# EAGLE design M32.v1.2 (EAGLE 7.3.0)

## Sheet 1 of 3
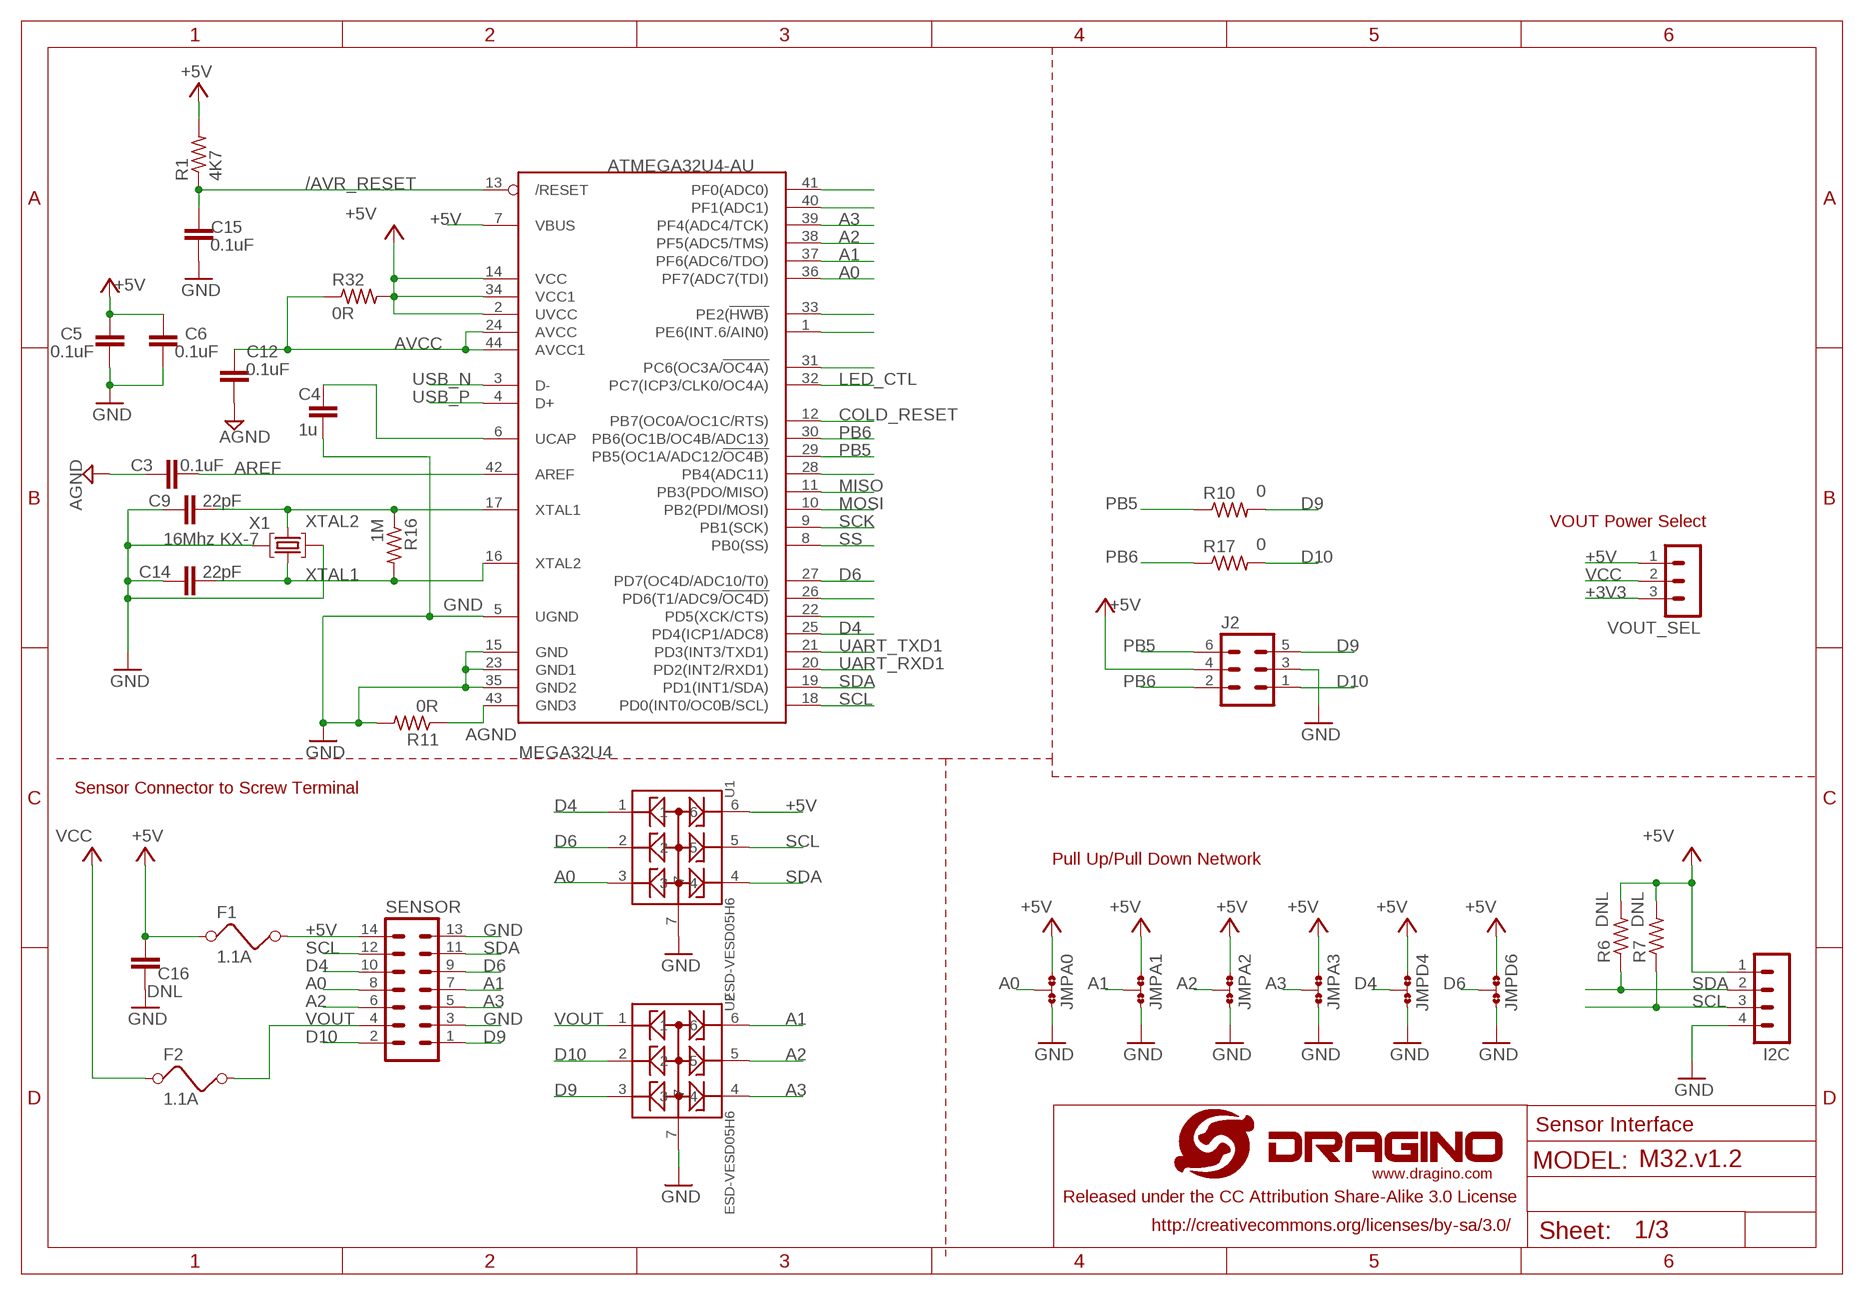
[diagram p0: schematic, sheet 1]

### Parts
C3  0.1uF  C-EUC0402  [C0402]
C4  1u  C-EUC0402  [C0402]
C5  0.1uF  C-EUC0402  [C0402]
C6  0.1uF  C-EUC0402  [C0402]
C9  22pF  C-EUC0402  [C0402]
C12  0.1uF  C-EUC0402  [C0402]
C14  22pF  C-EUC0402  [C0402]
C15  0.1uF  C-EUC0402  [C0402]
C16  DNL  C-EUC0402  [C0402]
F1  1.1A  FUSE1812  [L1812]
F2  1.1A  FUSE1812  [L1812]
I2C  MA04-1  [MA04-1]
J2  MA03-2  [MA03-2]
JMPA0  JUM-A2  0R-JUMPA  [A0R-JMP]
JMPA1  JUM-A2  0R-JUMPA  [A0R-JMP]
JMPA2  JUM-A2  0R-JUMPA  [A0R-JMP]
JMPA3  JUM-A2  0R-JUMPA  [A0R-JMP]
JMPD4  JUM-A2  0R-JUMPA  [A0R-JMP]
JMPD6  JUM-A2  0R-JUMPA  [A0R-JMP]
MEGA32U4  ATMEGA32U4-AU  [TQFP44]
R1  4K7  R-US_R0402  [R0402]
R6  DNL  R-US_R0603  [R0603]
R7  DNL  R-US_R0603  [R0603]
R10  0  R-US_R0603  [R0603]
R11  0R  R-US_R0603  [R0603]
R16  1M  R-US_R0402  [R0402]
R17  0  R-US_R0603  [R0603]
R32  0R  R-US_R0402  [R0402]
SENSOR  MA07-2  [MA07-2]
U1  ESD-VESD05H6  [VESD05A6]
U2  ESD-VESD05H6  [VESD05A6]
VOUT_SEL  MA03-1  [MA03-1]
X1  16Mhz KX-7  CRYSTAL-3.2-2.5  [CRYSTAL-3.2-2.5]

### Nets
32U4_A4: MEGA32U4.40(PF1(ADC1)) ; also sheet 3
32U4_A5: MEGA32U4.41(PF0(ADC0)) ; also sheet 3
+3V3: VOUT_SEL.3 ; also sheet 2
+5V: C5.1 C6.1 C16.1 F1.1 I2C.1 J2.4 JMPA0.3 JMPA1.3 JMPA2.3 JMPA3.3 JMPD4.3 JMPD6.3 MEGA32U4.2(UVCC) MEGA32U4.7(VBUS) MEGA32U4.14(VCC) MEGA32U4.34(VCC1) R1.2 R6.2 R7.2 R32.2 U1.6 VOUT_SEL.1 ; also sheet 2,3
/AVR_RESET: C15.1 MEGA32U4.13(/RESET) R1.1 ; also sheet 2,3
A0: JMPA0.2 MEGA32U4.36(PF7(ADC7(TDI)) SENSOR.8 U1.3 ; also sheet 3
A1: JMPA1.2 MEGA32U4.37(PF6(ADC6/TDO)) SENSOR.7 U2.6 ; also sheet 3
A2: JMPA2.2 MEGA32U4.38(PF5(ADC5/TMS)) SENSOR.6 U2.5 ; also sheet 3
A3: JMPA3.2 MEGA32U4.39(PF4(ADC4/TCK)) SENSOR.5 U2.4 ; also sheet 3
AGND: C3.1 MEGA32U4.43(GND3) R11.1 ; also sheet 3
AREF: C3.2 MEGA32U4.42(AREF) ; also sheet 3
AVCC: C12.1 MEGA32U4.24(AVCC) MEGA32U4.44(AVCC1) R32.1 ; also sheet 3
COLD_RESET: MEGA32U4.12(PB7(OC0A/OC1C/RTS)) ; also sheet 2,3
D4: JMPD4.2 MEGA32U4.25(PD4(ICP1/ADC8)) SENSOR.10 U1.1 ; also sheet 3
D6: JMPD6.2 MEGA32U4.27(PD7(OC4D/ADC10/T0)) SENSOR.9 U1.2 ; also sheet 3
D9: J2.5 R10.2 SENSOR.1 U2.3
D10: J2.1 R17.2 SENSOR.2 U2.2
GND [gnd]: C4.1 C5.2 C6.2 C9.1 C14.1 C15.2 C16.2 I2C.4 J2.3 JMPA0.1 JMPA1.1 JMPA2.1 JMPA3.1 JMPD4.1 JMPD6.1 MEGA32U4.5(UGND) MEGA32U4.15(GND) MEGA32U4.23(GND1) MEGA32U4.35(GND2) R11.2 SENSOR.3 SENSOR.13 U1.7 U2.7 X1.2(GND) X1.4(GND) ; also sheet 2,3
GND1: C12.2 ; supply symbol labelled AGND
LED_CTL: MEGA32U4.32(PC7(ICP3/CLK0/OC4A)) ; also sheet 2,3
MISO: MEGA32U4.11(PB3(PDO/MISO)) ; also sheet 2,3
MOSI: MEGA32U4.10(PB2(PDI/MOSI)) ; also sheet 2,3
N$1: F1.2 SENSOR.14
N$4: C4.2 MEGA32U4.6(UCAP) ; also sheet 3
PB4: MEGA32U4.28(PB4(ADC11)) ; also sheet 3
PB5: J2.6 MEGA32U4.29(PB5(OC1A/ADC12/!OC4B)) R10.1 ; also sheet 3
PB6: J2.2 MEGA32U4.30(PB6(OC1B/OC4B/ADC13)) R17.1 ; also sheet 3
PC6: MEGA32U4.31(PC6(OC3A/!OC4A)) ; also sheet 3
PD5: MEGA32U4.22(PD5(XCK/CTS)) ; also sheet 3
PD6: MEGA32U4.26(PD6(T1/ADC9/!OC4D)) ; also sheet 3
PE2: MEGA32U4.33(PE2(!HWB)) ; also sheet 3
PE6: MEGA32U4.1(PE6(INT.6/AIN0)) ; also sheet 3
SCK: MEGA32U4.9(PB1(SCK)) ; also sheet 2,3
SCL: I2C.3 MEGA32U4.18(PD0(INT0/OC0B/SCL)) R7.1 SENSOR.12 U1.5 ; also sheet 3
SDA: I2C.2 MEGA32U4.19(PD1(INT1/SDA)) R6.1 SENSOR.11 U1.4 ; also sheet 3
SS: MEGA32U4.8(PB0(SS)) ; also sheet 2,3
UART_RXD1: MEGA32U4.20(PD2(INT2/RXD1)) ; also sheet 2,3
UART_TXD1: MEGA32U4.21(PD3(INT3/TXD1)) ; also sheet 2,3
USB_N: MEGA32U4.3(D-) ; also sheet 2,3
USB_P: MEGA32U4.4(D+) ; also sheet 2,3
VCC: F2.1 VOUT_SEL.2
VOUT: F2.2 SENSOR.4 U2.1
XTAL1: C14.2 MEGA32U4.16(XTAL2) R16.2 X1.3(C2) ; also sheet 3
XTAL2: C9.2 MEGA32U4.17(XTAL1) R16.1 X1.1(C1) ; also sheet 3

### Notes on the sheet
- VOUT Power Select
- Sensor Connector to Screw Terminal
- Pull Up/Pull Down Network
- Sensor Interface

## Sheet 2 of 3
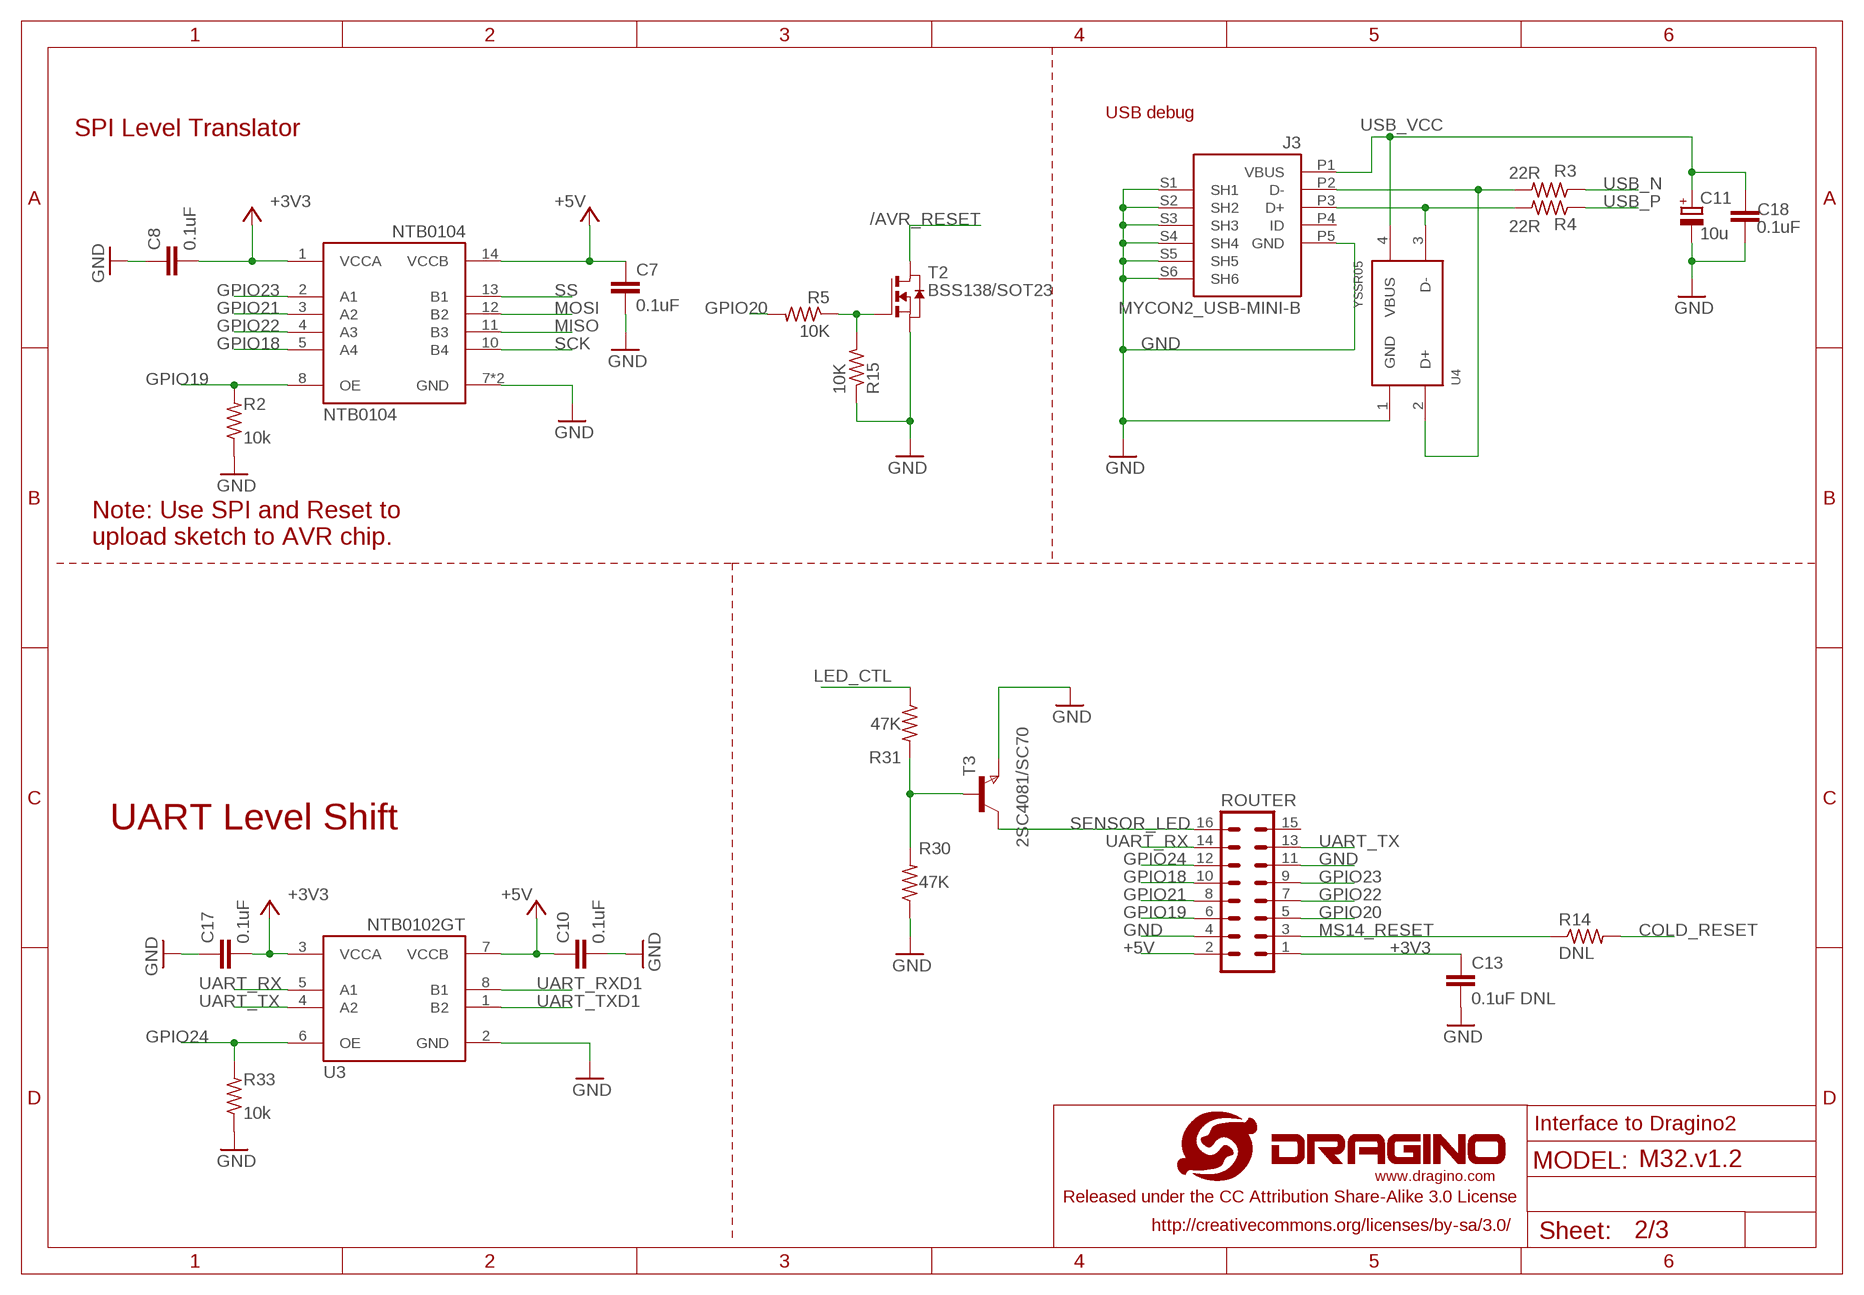
[diagram p1: schematic, sheet 2]

### Parts
C7  0.1uF  C-EUC0402  [C0402]
C8  0.1uF  C-EUC0402  [C0402]
C10  0.1uF  C-EUC0402  [C0402]
C11  10u  CPOL-EUSMCB  [SMC_B]
C13  0.1uF DNL  C-EUC0402  [C0402]
C17  0.1uF  C-EUC0402  [C0402]
C18  0.1uF  C-EUC0402  [C0402]
J3  MYCON2_USB-MINI-B  [CON2_USB_MICRO_B_AT]
NTB0104  NTB0104  [DHVQFN14]
R2  10k  R-US_R0402  [R0402]
R3  22R  R-US_R0402  [R0402]
R4  22R  R-US_R0402  [R0402]
R5  10K  R-US_R0402  [R0402]
R14  DNL  R-US_R0402  [R0402]
R15  10K  R-US_R0402  [R0402]
R30  47K  R-US_R0402  [R0402]
R31  47K  R-US_R0402  [R0402]
R33  10k  R-US_R0402  [R0402]
ROUTER  MA08-2  [MA08-2]
T2  BSS138/SOT23  NMOSFET-SOT23  [SOT-23]
T3  2SC4081/SC70  NPNSOT323  [SOT323]
U3  NTB0102GT  [NXP-SOT833-1]
U4  YSSR05  [SOT143]
U$5  LOGO-NEW  [LOGO-SILK-NEW]

### Nets
+3V3: C8.2 C13.1 C17.2 NTB0104.1(VCCA) ROUTER.1 U3.3(VCCA) ; also sheet 1
+5V: C7.1 C10.1 NTB0104.14(VCCB) ROUTER.2 U3.7(VCCB) ; also sheet 1,3
/AVR_RESET: T2.1(D) ; also sheet 1,3
COLD_RESET: R14.2 ; also sheet 1,3
GND [gnd]: C7.2 C8.1 C10.2 C11.- C13.2 C17.1 C18.2 J3.P5(GND) J3.S1(SH1) J3.S2(SH2) J3.S3(SH3) J3.S4(SH4) J3.S5(SH5) J3.S6(SH6) NTB0104.7(GND) NTB0104.EXP(GND) R2.1 R15.1 R30.1 R33.1 ROUTER.4 ROUTER.11 T2.2(S) T3.3(E) U3.2(GND) U4.1(GND) ; also sheet 1,3
GPIO18: NTB0104.5(A4) ROUTER.10
GPIO19: NTB0104.8(OE) R2.2 ROUTER.6
GPIO20: R5.2 ROUTER.5
GPIO21: NTB0104.3(A2) ROUTER.8
GPIO22: NTB0104.4(A3) ROUTER.7
GPIO23: NTB0104.2(A1) ROUTER.9
GPIO24: R33.2 ROUTER.12 U3.6(OE)
LED_CTL: R31.1 ; also sheet 1,3
MISO: NTB0104.11(B3) ; also sheet 1,3
MOSI: NTB0104.12(B2) ; also sheet 1,3
MS14_RESET: R14.1 ROUTER.3
N$8: R5.1 R15.2 T2.3(G)
N$9: R30.2 R31.2 T3.2(B)
SCK: NTB0104.10(B4) ; also sheet 1,3
SENSOR_LED: ROUTER.16 T3.1(C)
SS: NTB0104.13(B1) ; also sheet 1,3
UART_RX: ROUTER.14 U3.5(A1)
UART_RXD1: U3.8(B1) ; also sheet 1,3
UART_TX: ROUTER.13 U3.4(A2)
UART_TXD1: U3.1(B2) ; also sheet 1,3
USB1_N: J3.P2(D-) R3.2 U4.2(D+)
USB1_P: J3.P3(D+) R4.2 U4.3(D-)
USB_N: R3.1 ; also sheet 1,3
USB_P: R4.1 ; also sheet 1,3
USB_VCC: C11.+ C18.1 J3.P1(VBUS) U4.4(VBUS)
Unconnected: J3.P4(ID) ROUTER.15

### Notes on the sheet
- USB debug
- SPI Level Translator
- Note: Use SPI and Reset to 
  upload sketch to AVR chip.
- UART Level Shift
- Interface to Dragino2

## Sheet 3 of 3
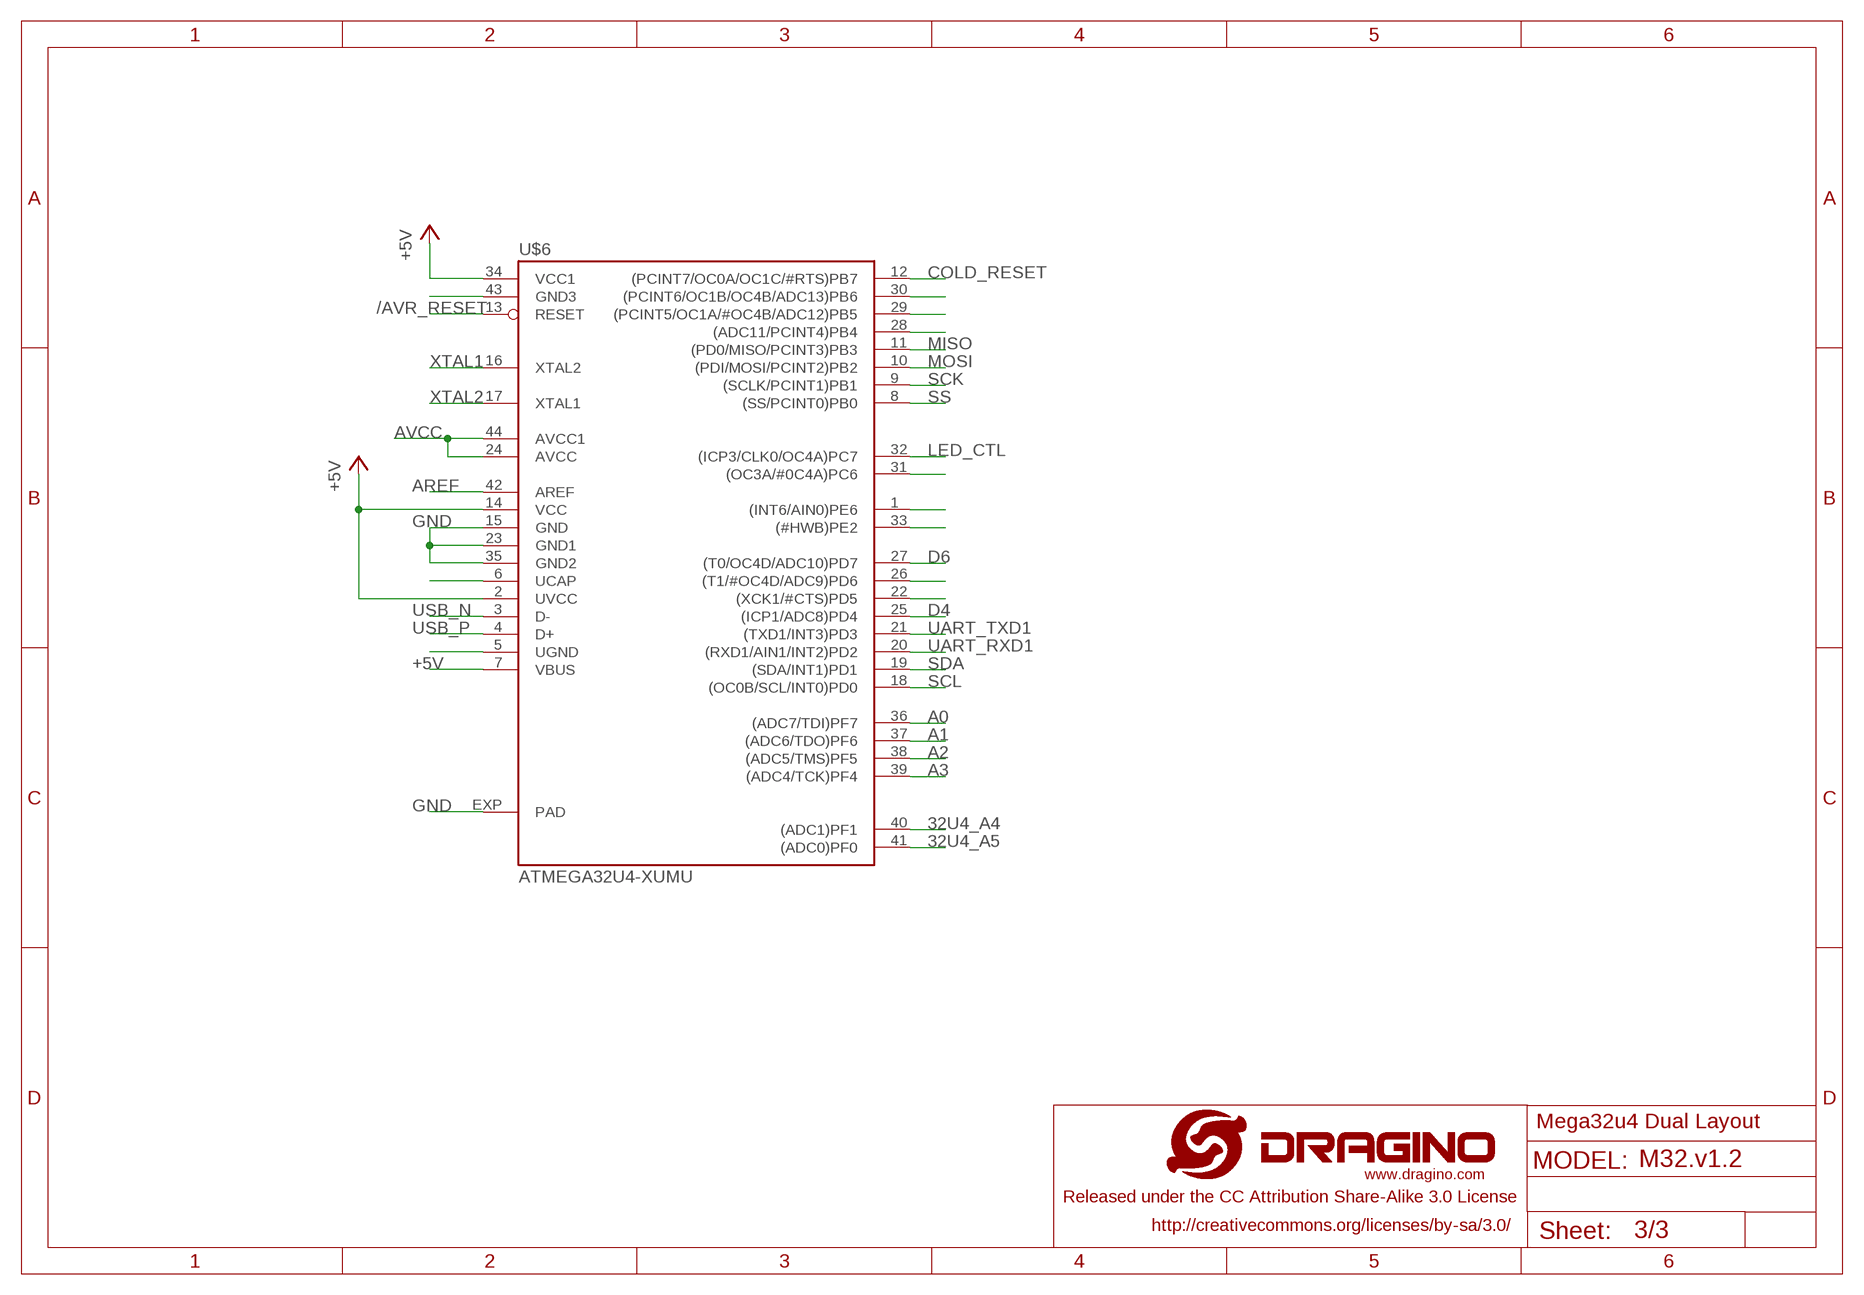
[diagram p2: schematic, sheet 3]

### Parts
U$6  ATMEGA32U4-XUMU  [QFN44ML7X7]

### Nets
32U4_A4: U$6.40((ADC1)PF1) ; also sheet 1
32U4_A5: U$6.41((ADC0)PF0) ; also sheet 1
+5V: U$6.2(UVCC) U$6.7(VBUS) U$6.14(VCC) U$6.34(VCC1) ; also sheet 1,2
/AVR_RESET: U$6.13(RESET) ; also sheet 1,2
A0: U$6.36((ADC7/TDI)PF7) ; also sheet 1
A1: U$6.37((ADC6/TDO)PF6) ; also sheet 1
A2: U$6.38((ADC5/TMS)PF5) ; also sheet 1
A3: U$6.39((ADC4/TCK)PF4) ; also sheet 1
AGND: U$6.43(GND3) ; also sheet 1
AREF: U$6.42(AREF) ; also sheet 1
AVCC: U$6.24(AVCC) U$6.44(AVCC1) ; also sheet 1
COLD_RESET: U$6.12((PCINT7/OC0A/OC1C/#RTS)PB7) ; also sheet 1,2
D4: U$6.25((ICP1/ADC8)PD4) ; also sheet 1
D6: U$6.27((T0/OC4D/ADC10)PD7) ; also sheet 1
GND [gnd]: U$6.5(UGND) U$6.15(GND) U$6.23(GND1) U$6.35(GND2) U$6.EXP(PAD) ; also sheet 1,2
LED_CTL: U$6.32((ICP3/CLK0/OC4A)PC7) ; also sheet 1,2
MISO: U$6.11((PD0/MISO/PCINT3)PB3) ; also sheet 1,2
MOSI: U$6.10((PDI/MOSI/PCINT2)PB2) ; also sheet 1,2
N$4: U$6.6(UCAP) ; also sheet 1
PB4: U$6.28((ADC11/PCINT4)PB4) ; also sheet 1
PB5: U$6.29((PCINT5/OC1A/#OC4B/ADC12)PB5) ; also sheet 1
PB6: U$6.30((PCINT6/OC1B/OC4B/ADC13)PB6) ; also sheet 1
PC6: U$6.31((OC3A/#0C4A)PC6) ; also sheet 1
PD5: U$6.22((XCK1/#CTS)PD5) ; also sheet 1
PD6: U$6.26((T1/#OC4D/ADC9)PD6) ; also sheet 1
PE2: U$6.33((#HWB)PE2) ; also sheet 1
PE6: U$6.1((INT6/AIN0)PE6) ; also sheet 1
SCK: U$6.9((SCLK/PCINT1)PB1) ; also sheet 1,2
SCL: U$6.18((OC0B/SCL/INT0)PD0) ; also sheet 1
SDA: U$6.19((SDA/INT1)PD1) ; also sheet 1
SS: U$6.8((SS/PCINT0)PB0) ; also sheet 1,2
UART_RXD1: U$6.20((RXD1/AIN1/INT2)PD2) ; also sheet 1,2
UART_TXD1: U$6.21((TXD1/INT3)PD3) ; also sheet 1,2
USB_N: U$6.3(D-) ; also sheet 1,2
USB_P: U$6.4(D+) ; also sheet 1,2
XTAL1: U$6.16(XTAL2) ; also sheet 1
XTAL2: U$6.17(XTAL1) ; also sheet 1

### Notes on the sheet
- Mega32u4 Dual Layout

## Library data of the parts
C3-C10 C12-C18 = dragino:C-EU: CAPACITOR, European symbol
C11 = rcl:CPOL-EU: POLARIZED CAPACITOR, European symbol
F1 F2 = dragino:FUSE: FUSE 5 x 20 mm
I2C = con-lstb:MA04-1: PIN HEADER; OC_FARNELL: unknown; OC_NEWARK: unknown
J2 = con-lstb:MA03-2: PIN HEADER; OC_FARNELL: unknown; OC_NEWARK: unknown
J3 = SmartPrj:MYCON2_USB-MINI-B
JMPA0 JMPA1-JMPA3 JMPD4 JMPD6 = jump-0r-smd:0R-JUMP: SMD 0R 0805 Jumper
MEGA32U4 = adafruit:ATMEGA32U4: http://www.ladyada.net/library/eagle
NTB0104 = dragino:NTB0104
R1-R5 R11 R14-R16 R30 R31 R33 = dragino:R-US_: RESISTOR, American symbol
R6 R7 R10 R17 R32 = rcl:R-US_: RESISTOR, American symbol
ROUTER = dragino:MA08-2: PIN HEADER; OC_FARNELL: unknown; OC_NEWARK: unknown
SENSOR = dragino:MA07-2: PIN HEADER; OC_FARNELL: unknown; OC_NEWARK: unknown
T2 = dragino:NMOSFET-SOT23: MOS FET; OC_FARNELL: unknown; OC_NEWARK: unknown
T3 = zetex:NPNSOT323: NPN TRANSISTOR; MPN: DSS4160U-7; OC_FARNELL: 1710696; OC_NEWARK: 25R4558
U1 U2 = dragino-passive:ESD-VESD05H6
U3 = dragino:NTB0102
U4 = dragino:YSSR05: Yeashin LOW CAPACITANCE TVS DIODE ARRAY http://www.yeashin.tw/download.php?id=4588
U$5 = dragino:LOGO-NEW
U$6 = dragino:ATMEGA32U4-XU
VOUT_SEL = con-lstb:MA03-1: PIN HEADER; OC_FARNELL: unknown; OC_NEWARK: unknown
X1 = SmartPrj:CRYSTAL-3.2-2.5

## Net classes
0 default: width 0.203 mm, clearance 0.254 mm
1 power: width 0.61 mm, drill 0.61 mm, clearance 0.254 mm
2 gnd: width 0.305 mm, drill 0.33 mm, clearance 0.254 mm
3 usbvcc: width 0.508 mm, drill 0.61 mm, clearance 0.254 mm
4 aref: width 0.406 mm, drill 0.61 mm, clearance 0.254 mm

## Board
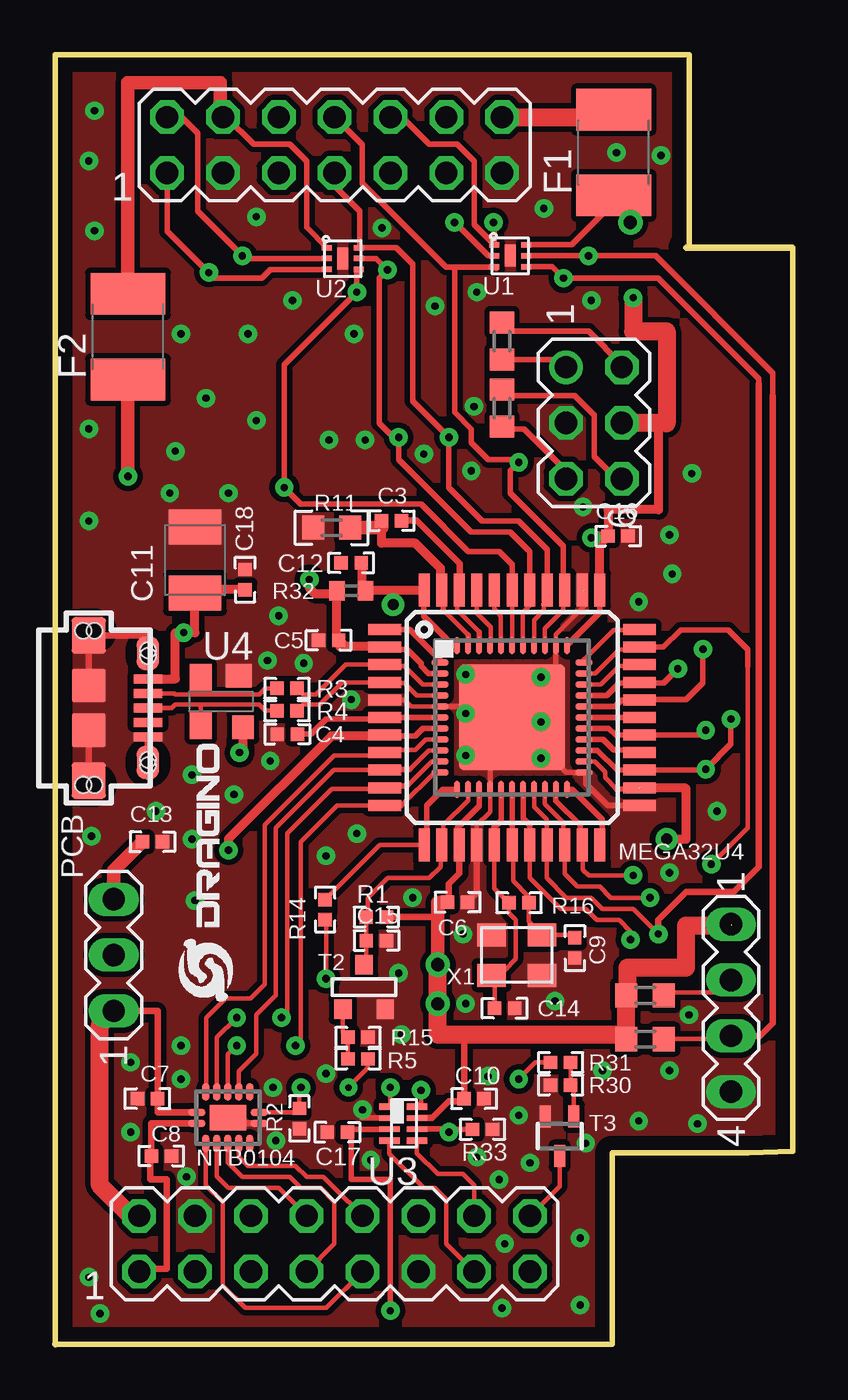
[diagram p3: board, top side]
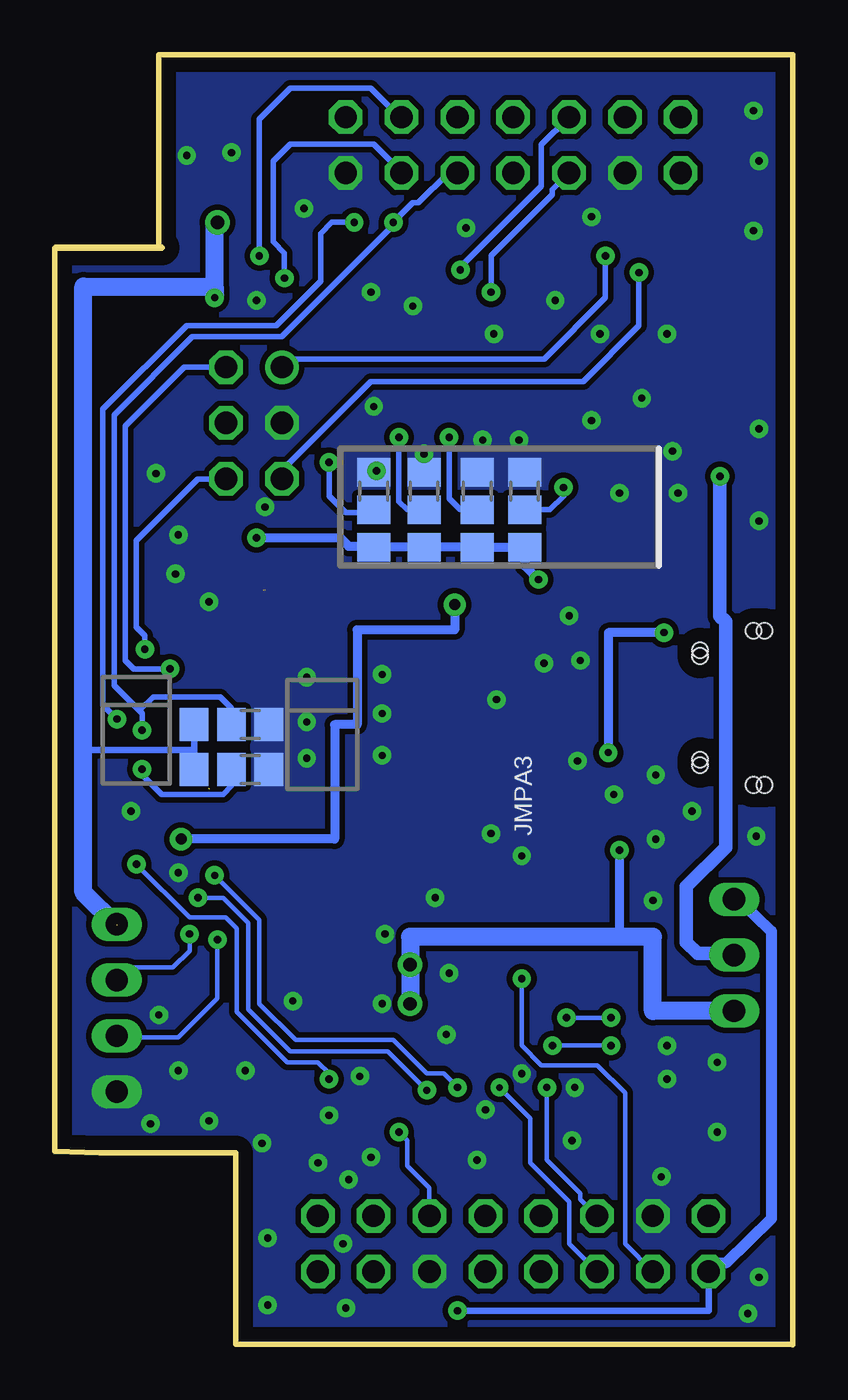
[diagram p4: board, bottom side, seen from below]

Size 33.57 x 58.69 mm. Coordinates in mm from the lower left corner, seen from the top.
Outline: 28.84,49.96 28.84,58.69 0.02,58.69 0.02,0
Outline: 33.57,49.9 33.57,8.8 31.53,8.73 25.35,8.73 25.35,0.02 0,0.02
Outline: 28.72,49.93 33.54,49.93
Copper layers (1*16): Top 0.035mm / dielectric 1.5mm / Bottom 0.035mm
Design rules "default": minimum track width 5mil, minimum drill 10mil, track to track 6mil, track to pad 7mil, pad to pad 7mil, via to via 10mil, smd to smd 7mil, copper to edge 26mil, drill to drill 10mil, minimum pad ring 10mil, minimum via ring 10mil, stop-mask expansion 1mil, vias tented up to drill 30mil, thermal gap 10mil

### Footprints (pad centres in the part's own frame; a part is rotated, then mirrored left to right if it is on the bottom)
C0402 = smd 0.61 x 0.61: 1 -0.457,0; 2 0.457,0
SMC_B = smd 1.6 x 2.4: + -1.5,0; - 1.5,0
L1812 = smd 1.9 x 3.4: 1 -1.95,0; 2 1.95,0
MA04-1 = drill 1.016 long: 1 -3.81,0; 2 -1.27,0; 3 1.27,0; 4 3.81,0
MA03-2 = drill 1.016: 1 -2.54,-1.27 | drill 1.016 octagon: 2 -2.54,1.27; 3 0,-1.27; 4 0,1.27; 5 2.54,-1.27; 6 2.54,1.27
CON2_USB_MICRO_B_AT = smd 0.406 x 1.346: P1 -1.321,2.692; P2 -0.66,2.692; P3 0,2.692; P4 0.66,2.692; P5 1.321,2.692 | smd 1.651 x 1.549: S1 -3.302,0; S2 3.302,0 | smd 1.524 x 1.016: S3 -2.489,2.692; S4 2.489,2.692 | smd 1.524 x 1.524: S5 -1.016,0; S6 1.016,0 | hole 0.7: -3.505,0.254; -3.505,-0.254; 3.505,0.254; 3.505,-0.254; -2.616,2.692; -2.362,2.692; 2.362,2.692; 2.616,2.692
A0R-JMP = smd 1.5 x 1.3: 1 0,1.7; 2 0,0; 3 0,-1.7
TQFP44 = smd 1.5 x 0.5: 1 -5.8,4; 2 -5.8,3.2; 3 -5.8,2.4; 4 -5.8,1.6; 5 -5.8,0.8; 6 -5.8,0; 7 -5.8,-0.8; 8 -5.8,-1.6; 9 -5.8,-2.4; 10 -5.8,-3.2; 11 -5.8,-4; 23 5.8,-4; 24 5.8,-3.2; 25 5.8,-2.4; 26 5.8,-1.6; 27 5.8,-0.8; 28 5.8,0; 29 5.8,0.8; 30 5.8,1.6; 31 5.8,2.4; 32 5.8,3.2; 33 5.8,4 | smd 0.5 x 1.5: 12 -4,-5.8; 13 -3.2,-5.8; 14 -2.4,-5.8; 15 -1.6,-5.8; 16 -0.8,-5.8; 17 0,-5.8; 18 0.8,-5.8; 19 1.6,-5.8; 20 2.4,-5.8; 21 3.2,-5.8; 22 4,-5.8; 34 4,5.8; 35 3.2,5.8; 36 2.4,5.8; 37 1.6,5.8; 38 0.8,5.8; 39 0,5.8; 40 -0.8,5.8; 41 -1.6,5.8; 42 -2.4,5.8; 43 -3.2,5.8; 44 -4,5.8
DHVQFN14 = smd 0.8 x 0.35: 1 -1.425,-0.25; 7 1.425,-0.25; 8 1.425,0.25; 14 -1.425,0.25 | smd 0.35 x 0.8: 2 -1,-1.175; 3 -0.5,-1.175; 4 0,-1.175; 5 0.5,-1.175; 6 1,-1.175; 9 1,1.175; 10 0.5,1.175; 11 0,1.175; 12 -0.5,1.175; 13 -1,1.175 | smd 1.65 x 1.15: EXP 0,0
R0402 = smd 0.61 x 0.61: 1 -0.457,0; 2 0.457,0
R0603 = smd 1 x 1.1: 1 -0.85,0; 2 0.85,0
R0402' = smd 0.7 x 0.9: 1 -0.65,0; 2 0.65,0
MA08-2 = drill 1.016 octagon: 1 -8.89,-1.27; 2 -8.89,1.27; 3 -6.35,-1.27; 4 -6.35,1.27; 5 -3.81,-1.27; 6 -3.81,1.27; 7 -1.27,-1.27; 8 -1.27,1.27; 9 1.27,-1.27; 10 1.27,1.27; 11 3.81,-1.27; 12 3.81,1.27; 13 6.35,-1.27; 14 6.35,1.27; 15 8.89,-1.27; 16 8.89,1.27
MA07-2 = drill 1.016 octagon: 1 -7.62,-1.27; 2 -7.62,1.27; 3 -5.08,-1.27; 4 -5.08,1.27; 5 -2.54,-1.27; 6 -2.54,1.27; 7 0,-1.27; 8 0,1.27; 9 2.54,-1.27; 10 2.54,1.27; 11 5.08,-1.27; 12 5.08,1.27; 13 7.62,-1.27; 14 7.62,1.27
SOT-23 = smd 0.787 x 0.889: 1 0.025,-1.016; 2 -0.94,1.016; 3 0.991,1.016
SOT323 = smd 0.5 x 1: 1 0,0.9; 2 -0.65,-0.9; 3 0.65,-0.9
VESD05A6 = smd 0.45 x 0.25: 1 -0.725,0.5; 2 -0.725,0; 3 -0.725,-0.5; 4 0.725,-0.5; 5 0.725,0; 6 0.725,0.5 | smd 0.5 x 1: 7 0,0
NXP-SOT833-1 = smd 1 x 0.3: 1 -0.614,0.778 | smd 0.95 x 0.25: 2 -0.639,0.253; 3 -0.639,-0.247; 6 0.611,-0.247; 7 0.611,0.253 | smd 0.95 x 0.3: 4 -0.639,-0.772; 5 0.611,-0.772; 8 0.611,0.778
SOT143 = smd 1.194 x 1.067: 1 -0.72,-1.207 | smd 0.991 x 1.194: 2 1.007,-1.143; 3 1.007,1.067 | smd 0.991 x 1.067: 4 -0.923,1.13
QFN44ML7X7 = smd 0.75 x 0.275: 1 -3.275,2.5; 2 -3.275,2; 3 -3.275,1.5; 4 -3.275,1; 5 -3.275,0.5; 6 -3.275,0; 7 -3.275,-0.5; 8 -3.275,-1; 9 -3.275,-1.5; 10 -3.275,-2; 11 -3.275,-2.5; 23 3.275,-2.5; 24 3.275,-2; 25 3.275,-1.5; 26 3.275,-1; 27 3.275,-0.5; 28 3.275,0; 29 3.275,0.5; 30 3.275,1; 31 3.275,1.5; 32 3.275,2; 33 3.275,2.5 | smd 0.275 x 0.75: 12 -2.5,-3.275; 13 -2,-3.275; 14 -1.5,-3.275; 15 -1,-3.275; 16 -0.5,-3.275; 17 0,-3.275; 18 0.5,-3.275; 19 1,-3.275; 20 1.5,-3.275; 21 2,-3.275; 22 2.5,-3.275; 34 2.5,3.275; 35 2,3.275; 36 1.5,3.275; 37 1,3.275; 38 0.5,3.275; 39 0,3.275; 40 -0.5,3.275; 41 -1,3.275; 42 -1.5,3.275; 43 -2,3.275; 44 -2.5,3.275 | smd 4.826 x 4.826: EXP 0,0
MA03-1 = drill 1.016 long: 1 -2.54,0; 2 0,0; 3 2.54,0
CRYSTAL-3.2-2.5 = smd 1.3 x 1.05: 1 -1.15,-0.925; 2 1.15,-0.925; 3 1.15,0.925; 4 -1.15,0.925

### Placement (x,y rotation side)
C3  15.31,37.5 0 top
C4  10.57,27.78 0 top
C5  12.45,32.05 180 top
C6  18.31,20.13 0 top
C7  4.21,11.19 180 top
C8  4.84,8.58 180 top
C9  23.65,18.05 90 top
C10  19.07,11.19 0 top
C11  6.37,35.7 90 top
C12  13.48,35.58 180 top
C13  4.43,22.88 0 top
C14  20.46,15.31 180 top
C15  14.62,18.39 0 top
C16  25.62,36.79 0 top
C17  12.84,9.67 0 top
C18  8.65,34.81 90 top
F1  25.42,54.24 90 top
F2  3.32,45.86 90 top
I2C  30.76,15.32 270 top
J2  24.52,41.94 270 top
J3  1.54,28.97 270 top
JMPA0  19.07,37.99 0 bottom
JMPA1  16.78,37.99 0 bottom
JMPA2  14.37,37.99 0 bottom
JMPA3  12.21,37.99 0 bottom
JMPD4  25.54,26.18 270 bottom
JMPD6  25.54,28.21 270 bottom
MEGA32U4  20.79,28.54 0 top
NTB0104  7.87,10.33 0 top
R1  14.62,19.46 0 top
R2  11.12,10.29 90 top
R3  10.56,29.86 180 top
R4  10.56,28.84 180 top
R5  13.78,13 0 top
R6  26.85,15.89 180 top
R7  26.85,13.9 180 top
R10  20.34,42.62 270 top
R11  12.59,37.17 180 top
R14  12.29,19.8 90 top
R15  13.78,13.99 180 top
R16  21.11,20.11 180 top
R17  20.34,45.66 270 top
R30  23,11.81 0 top
R31  23,12.84 0 top
R32  0R  [R0402']  13.48,34.31 180 top
R33  19.45,9.8 180 top
ROUTER  12.72,4.59 0 top
SENSOR  12.72,54.59 0 top
T2  14.09,16.27 180 top
T3  22.96,9.49 180 top
U1  20.72,49.55 0 top
U2  13.1,49.42 0 top
U3  15.86,10.06 0 top
U4  7.64,29.23 180 top
U$5  8.09,15.62 90 top
U$6  20.79,28.54 0 top
VOUT_SEL  2.67,17.72 90 top
X1  21.01,17.73 180 top

### Tracks (layer width: path | path; a pad name or v marks a point on that pad's centre or on a via)
32U4_A4
  Top 0.203: MEGA32U4.40 19.99,33.51 20.29,33.16 20.29,31.86 U$6.40
32U4_A5
  Top 0.203: MEGA32U4.41 19.19,33.29 19.83,32.66 19.83,31.85 U$6.41
+3V3  (via drill 0.33)
  Top 0.254: 15.22,9.8 13.48,9.8 | 13.3,9.8 13.48,9.8 | 13.48,9.8 13.48,7.51 15.26,7.51 v15.26,1.54 | 15.26,9.8 15.22,9.8 | 15.22,9.8 U3.3
  Top 0.305: NTB0104.1 4.38,10.08 C8.2 4.33,8.59 4.33,7.51 5.1,7.51 5.1,3.45 3.83,3.45 ROUTER.1 | 13.3,9.8 C17.2
  Top 0.61: VOUT_SEL.3 2.67,21.58 C13.1
  Bottom 0.305: v15.26,1.54 3.83,1.54 ROUTER.1
  Bottom 0.508: VOUT_SEL.3 2.48,20.26 0.98,18.81 0.98,5.73 3.06,3.7 3.45,3.7 ROUTER.1
+5V  (via drill 0.33, 0.6)  (1 unrouted)
  Top 0.254: U$6.7 16.74,28.04 16.4,27.7 14.99,27.7 MEGA32U4.7 15.03,27.7 | U$6.14 19.29,24.5 18.3,23.51 18.3,22.83 MEGA32U4.14 | U$6.2 16.99,30.54 16.65,30.88 16.65,31 16.02,31.64 15.51,31.64 | U$6.34 24.79,33.31 MEGA32U4.34 | F1.1 25.42,51.96 23.51,50.05 21.58,50.05 U1.6
  Top 0.305: 15.51,31.64 15.09,31.64 MEGA32U4.2 | MEGA32U4.14 18.39,21.44 17.92,20.97 17.92,20.2 C6.1 17.18,19.46 R1.2 | NTB0104.14 4.67,10.58 C7.1 4.67,15.18 VOUT_SEL.1 | 18.56,14.11 18.61,14.06 C10.1 18.48,11.06 17.92,11.06 17.17,10.31 U3.7
  Top 0.406: MEGA32U4.14 18.43,22.89 | MEGA32U4.7 15,27.7 | 15.02,31.77 13.22,31.77 | 13.22,31.77 12.97,31.77 | 13.22,31.77 13.1,31.89 C5.1 12.83,32.05 R32.2 | 15.04,31.77 15.02,31.77 | 15.02,31.77 MEGA32U4.2 | R32.2 12.84,34.31 | 25.79,41.93 27.45,41.93 27.45,37.99 25.16,37.99 C16.1 | 15.03,27.7 12.59,27.7 7.89,23 v7.89,22.49 | C16.1 24.47,36.79 v24.4,36.72 | v11.57,34.81 11.57,34.43 11.83,34.18 12.7,34.18 R32.2 | MEGA32U4.34 24.79,36.42 C16.1
  Top 0.61: 12.72,34.19 R32.2 | C6.1 17.41,20.13 v17.41,17.29
  Top 0.813: ROUTER.2 3.45,5.86 2.05,7.25 2.05,14.56 VOUT_SEL.1 | v17.41,17.29 17.41,14.11 18.56,14.11 26,14.11 R7.2 R6.2 26.05,15.89 26.05,17.16 28.72,17.16 28.72,19.07 30.69,19.07 I2C.1 | v26.18,51.07 26.18,52.3 F1.1 | v26.3,47.64 26.3,46.12 27.83,46.12 27.83,41.93 25.79,41.93 J2.4
  Bottom 0.305: JMPD6.3 27.24,27.07 | 27.24,27.07 32.27,27.07 | JMPD4.3 27.24,27.07
  Bottom 0.406: v7.89,22.49 7.89,18.81 8.14,18.56 | v24.4,36.72 20.59,36.72 20.21,36.34 19.12,36.34 JMPA0.3 JMPA1.3 JMPA2.3 JMPA3.3 12.21,35.45 v11.57,34.81
  Bottom 0.813: VOUT_SEL.1 6.37,15.18 6.37,18.56 8.14,18.56 17.41,18.56 v17.41,17.29 v17.41,15.51 | 30.76,19.07 32.27,20.58 32.27,27.07 32.27,48.15 26.3,48.15 v26.3,47.64 26.3,51.07 v26.18,51.07
/AVR_RESET
  Top 0.203: T2.1 14.16,17.39 C15.1 R1.1 14.24,19.53 14.24,20.34 15.13,21.22 17.03,21.22 17.54,21.73 17.54,22.69 MEGA32U4.13 17.67,22.82 17.67,23.64 18.79,24.76 U$6.13
A0  (via drill 0.33)
  Top 0.203: U$6.36 22.29,32.58 23.13,33.42 23.13,33.67
  Top 0.254: 23.13,33.67 23.26,33.8 | MEGA32U4.36 23.13,34.4 23.13,36.34 20.72,38.75 20.72,39.77 v21.1,40.15 21.1,40.27 19.7,40.27 18.94,41.04 18.94,41.67 18.18,42.43 18.18,48.91 18.05,49.04 | 20.08,48.96 U1.3 18.05,49.04 | 18.05,49.04 17.8,49.04 13.99,52.85 13.99,54.6 SENSOR.8
  Top 0.305: 23.26,33.8 23.26,34.28 MEGA32U4.36
  Bottom 0.254: 19.57,38.5 JMPA0.2 19.19,37.86 20.34,37.86 21.1,38.62 v21.1,40.15
A1  (via drill 0.33)
  Top 0.203: U$6.37 21.79,32.97 22.24,33.42 22.24,33.67
  Top 0.254: 22.24,33.67 22.37,33.8 | MEGA32U4.37 22.39,36.19 21.1,37.48 19.45,37.48 17.92,39 v17.92,41.29 16.27,42.94 16.27,49.16 15.52,49.92 U2.6 13.86,49.96 13.86,51.58 12.72,52.71 SENSOR.7
  Top 0.305: MEGA32U4.37 22.39,33.82 22.37,33.8
  Bottom 0.254: v17.92,41.29 17.92,38.37 17.54,37.99 JMPA1.2
A2  (via drill 0.33)
  Top 0.203: 21.59,33.66 21.28,33.29 21.28,31.83 U$6.38
  Top 0.254: 21.59,33.66 MEGA32U4.38 21.59,36.1 20.72,36.97 18.94,36.97 15.64,40.27 v15.64,41.29 15.38,41.29 14.75,41.93 14.75,48.53 v15.13,48.91 | U2.5 14.62,49.42 v15.13,48.91 | v15.13,48.91 14.88,48.66
  Bottom 0.254: v15.64,41.29 15.64,38.5 15.13,37.99 JMPA2.2 | SENSOR.6 11.45,54.6 11.45,52.72 15.13,49.04 v15.13,48.91
A3  (via drill 0.33)
  Top 0.203: U$6.39 MEGA32U4.39
  Top 0.254: MEGA32U4.39 20.79,35.5 20.21,36.08 18.81,36.08 16.65,38.24 11.19,38.24 v10.43,39 10.43,44.59 v13.73,47.89 13.73,48.83 U2.4
  Bottom 0.254: v10.43,39 10.43,38.62 11.06,37.99 JMPA3.2 | SENSOR.5 10.94,52.56 10.94,52.34 13.73,49.55 v13.73,47.89
AGND
  Top 0.203: 18.79,32.29 17.67,33.42 | MEGA32U4.43 17.59,33.87 17.67,33.8
  Top 0.254: U$6.43 18.79,32.29 | 17.67,33.42 17.67,33.8
  Top 0.406: MEGA32U4.43 17.54,34.34 17.54,35.32 16.4,36.46 14.86,36.46 C3.1
  Top 0.61: C3.1 14.86,37.17 R11.1
AREF
  Top 0.203: 19.29,32.43 18.3,33.42 18.3,33.92
  Top 0.254: U$6.42 19.29,32.43
  Top 0.305: 18.3,33.92 18.39,34.01 MEGA32U4.42 18.41,35.55 16.46,37.5 C3.2
AVCC  (via drill 0.51 pad 0.81)  (1 unrouted)
  Top 0.203: U$6.24 24.55,26.54 25.03,26.05 25.03,25.8 25.54,25.29
  Top 0.254: U$6.44 18.13,31.81 16.78,33.16 16.78,34.33 MEGA32U4.44 | 26.54,25.29 25.54,25.29
  Top 0.305: MEGA32U4.24 26.67,25.42
  Top 0.406: R32.1 14.14,34.34 | v27.83,23 28.72,23 28.72,25.29 28.64,25.34 MEGA32U4.24 | 14.14,34.34 15.35,34.34 15.38,34.31 | 14.14,34.34 13.99,34.34 13.99,35.58 C12.1 | MEGA32U4.44 16.79,34.31 15.38,34.31 | v15.38,33.67 15.38,34.31
  Bottom 0.406: v15.38,33.67 15.38,32.53 19.83,32.53 19.83,28.21 20.84,28.21 20.84,23 v27.83,23
COLD_RESET
  Top 0.203: R14.2 14.78,22.74 MEGA32U4.12
  Top 0.254: U$6.12 17.65,25.26 16.91,24.53 16.91,22.85 MEGA32U4.12
D4  (via drill 0.33)
  Top 0.254: 26.55,26.18 MEGA32U4.25 | SENSOR.10 15.8,55.86 17.03,54.63 18.3,54.63 19.07,53.86 19.07,50.97 U1.1 19.99,51.03 v19.95,51.07 | v30.75,28.46 30.75,27.32 v29.61,26.18 29.57,26.14 MEGA32U4.25 | U$6.25 24.68,27.04 25.58,26.14 MEGA32U4.25
  Top 0.305: MEGA32U4.25 26.77,26.14 26.81,26.18
  Bottom 0.254: 25.67,26.3 JMPD4.2 25.54,25.42 25.92,25.04 28.72,25.04 29.61,25.92 v29.61,26.18 | v30.75,28.46 31.38,29.1 31.38,42.56 27.57,46.37 23.51,46.37 21.48,48.4 21.48,50.56 20.97,51.07 v19.95,51.07
D6  (via drill 0.33)
  Top 0.254: v29.61,27.96 29.39,27.74 MEGA32U4.27 25.5,27.74 25.2,28.04 U$6.27 | v18.18,51.07 19.7,49.55 U1.2
  Bottom 0.254: 25.54,28.46 JMPD6.2 25.54,28.97 26.05,29.48 29.1,29.48 29.73,28.84 | v29.61,27.96 29.61,28.72 29.73,28.84 | 29.73,28.84 30.88,29.99 30.88,42.31 27.32,45.86 23.26,45.86 18.18,50.94 v18.18,51.07 17.29,51.96 17.03,51.96 15.68,53.32 SENSOR.9
D9  (via drill 0.33)
  Top 0.254: J2.5 23.25,39.78 21.35,41.67 20.51,41.67 R10.2 | SENSOR.1 5.1,50.68 v7,48.78 7.26,48.53 9.41,48.53 9.8,48.92 U2.3
  Bottom 0.254: v7,48.78 7,46.37 9.54,43.83 19.19,43.83 23.13,39.89 23.13,39.52 J2.5
D10  (via drill 0.33)
  Top 0.254: R17.2 22.92,44.81 J2.1 | SENSOR.2 5.77,55.86 6.49,55.13 6.49,51.58 v8.53,49.55 8.65,49.42 U2.2
  Bottom 0.254: v8.53,49.55 8.53,47.64 11.32,44.85 22.88,44.85 J2.1
GND  (via drill 0.33)  (1 unrouted)
  Top 0.203: U$6.15 19.79,24.24 19.19,23.64 MEGA32U4.15 | MEGA32U4.15 | MEGA32U4.5 15.9,29.34 16.2,29.04 U$6.5 | U$6.35 22.79,32.32 24.1,33.62 24.1,34.31
  Top 0.254: U$6.5 20.29,29.04 U$6.EXP | U$6.35 22.79,30.54 U$6.EXP | U$6.15 19.79,27.16 20.59,27.96 | 20.59,27.96 20.59,28.34 U$6.EXP | MEGA32U4.23 25.15,24.54 24.15,25.54 24.15,25.96 U$6.23 23.27,26.04 23,26.3 22.24,26.3 20.59,27.96 | U3.2 13.99,10.31 v13.99,10.68
  Top 0.305: MEGA32U4.15 19.19,20.56 C6.2 | NTB0104.7 7.87,10.08 NTB0104.EXP | J3.S2 J3.S6 | J3.S3 4.23,32.27 J3.S1 J3.S5 | J3.S4 J3.P5
  other vias: 15.76,14.11 15.64,16.91 22.75,15.64 18.56,18.68 18.69,15.51 19.7,12.21 21.1,10.43 20.21,7.51 19.19,8.52 21.61,8.27 20.46,4.59 20.34,1.67 23.89,1.79 23.89,4.84 24.15,9.16 24.91,12.46 27.96,12.46 26.56,10.18 29.23,10.05 28.84,15 30.12,24.27 27.96,21.48 22.11,26.69 22.11,28.34 22.11,30.37 18.69,30.5 18.69,28.72 18.69,26.81 12.33,22.24 13.73,23.26 16.27,20.34 5.99,7.64 10.05,9.29 9.92,11.7 14.37,8.4 12.33,12.34 5.73,12.08 5.73,13.6 3.45,12.84 3.45,9.67 2.05,1.41 1.54,3.06 6.37,20.21 4.59,24.27 6.24,25.92 8.14,25.04 6.24,23 1.67,23.13 9.79,26.56 13.48,29.35 9.67,31.13 11.32,31 10.18,33.16 1.54,41.67 1.54,37.48 6.87,43.07 5.48,40.66 5.22,38.75 7.89,38.75 9.16,42.05 12.46,41.16 14.11,41.16 13.61,45.99 17.29,47.26 10.81,47.51 8.78,45.99 5.73,45.99 9.16,51.32 1.54,53.86 1.79,56.15 1.79,50.69 22.24,51.7 25.54,54.24 27.57,54.12 19.19,47.89 14.88,50.82 24.4,47.51 28.97,39.64 26.56,33.8 28.08,35.07 27.96,36.85 24.02,38.12 16.78,40.53 18.94,39.77 19.07,42.69
  pour Top (rank 2, no thermals): 0.02,58.56 25.29,58.72 28.97,58.72 28.72,49.93 33.57,49.93 33.57,14.11 33.54,8.81 25.4,8.89 25.42,0.02 0.02,-0.11
  pour Bottom (rank 2, no thermals): 0.02,58.82 0.02,-0.11 25.42,-0.11 25.41,8.68 33.57,8.78 33.57,50.1 28.79,49.84 28.84,58.56
GPIO18
  Top 0.203: NTB0104.5 8.37,8.55 8.78,8.14 10.94,8.14 11.45,7.64 12.21,7.64 13.35,6.49 13.36,6.49 ROUTER.10
GPIO19  (via drill 0.33)
  Top 0.203: v11.19,11.7 11.12,11.63 R2.2 10.95,10.58 NTB0104.8
  Bottom 0.203: ROUTER.6 9.67,6.61 9.67,6.87 11.19,8.4 v11.19,11.7
GPIO20  (via drill 0.3)
  Top 0.203: v13.35,11.7 14.24,12.59 R5.2
  Bottom 0.203: ROUTER.5 10.18,4.59 10.18,6.49 11.95,8.27 11.95,10.3 v13.35,11.7
GPIO21
  Top 0.203: NTB0104.3 7.37,7.65 7.89,7.13 10.18,7.13 ROUTER.8
GPIO22
  Top 0.203: NTB0104.4 7.87,8.29 8.53,7.64 10.68,7.64 11.19,7.13 12.08,7.13 12.72,6.49 12.72,4.58 ROUTER.7
GPIO23
  Top 0.203: NTB0104.2 6.87,7.26 7.64,6.49 7.64,2.68 8.65,1.67 12.34,1.67 ROUTER.9
GPIO24  (via drill 0.33)
  Top 0.254: U3.6 17.92,9.81 v17.92,9.67 17.92,9.8 R33.2
  Bottom 0.203: ROUTER.12 16.53,7.14 17.54,8.14 17.54,9.29 v17.92,9.67
LED_CTL  (via drill 0.33)
  Top 0.203: U$6.32 24.57,30.54 25.67,31.64 26.49,31.64 | R31.1 21.86,12.84 v21.1,12.08 | v29.86,21.86 31.51,23.51 31.51,30.88
  Top 0.254: 26.49,31.64 MEGA32U4.32 27.68,31.74 28.46,32.53 30.62,32.53 31.51,31.64 31.51,30.88
  Bottom 0.203: v21.1,12.08 21.1,12.34 21.61,12.84 23,12.84 25.29,15.13 25.29,18.94 25.8,19.45 27.45,19.45 v29.86,21.86
MISO  (via drill 0.33)
  Top 0.203: 17.28,26.04 15.76,24.53 | NTB0104.11 7.87,13.2 v8.27,13.6 | v10.94,13.6 11.19,13.86 11.19,22.88 12.84,24.53 14.98,24.53 MEGA32U4.11
  Top 0.254: U$6.11 17.28,26.04 | 15.76,24.53 15.01,24.53 MEGA32U4.11
  Bottom 0.203: v8.27,13.6 v10.94,13.6
MOSI  (via drill 0.33)
  Top 0.203: 14.96,25.29 MEGA32U4.10 14.94,25.29 12.59,25.29 10.56,23.26 10.56,15.13 v10.3,14.88 | U$6.10 17.14,26.54 16.02,25.42 | NTB0104.12 7.37,13.97 v8.27,14.88
  Top 0.254: 16.02,25.42 15.07,25.42 MEGA32U4.10
  Bottom 0.203: v8.27,14.88 v10.3,14.88
MS14_RESET  (via drill 0.33)
  Top 0.203: v12.33,16.65 12.33,19.29 R14.1
  Bottom 0.203: ROUTER.3 7.64,4.58 7.64,11.45 8.91,12.72 11.45,12.72 12.33,13.6 v12.33,16.65
N$1
  Top 0.813: SENSOR.14 25.08,55.86 F1.2
N$4
  Top 0.254: U$6.6 MEGA32U4.6 14.92,28.46 12.33,28.46 11.65,27.78 C4.2
N$8
  Top 0.203: R5.1 R15.2 13.1,14.21 T2.3
N$9
  Top 0.203: R31.2 R30.2 23.61,11.8 T3.2
PB4
  Top 0.254: U$6.28 MEGA32U4.28
PB5  (via drill 0.33)
  Top 0.254: U$6.29 25.48,29.04 25.78,29.34 MEGA32U4.29 26.61,29.35 28.72,29.35 29.48,30.11 v29.48,31.64 | J2.6 25.53,39.4 24.53,40.4 24.53,42.31 23.64,43.2 20.69,43.2 R10.1 20.56,43.32
  Bottom 0.254: v29.48,31.64 29.48,32.27 29.86,32.66 29.86,36.59 27.07,39.39 25.8,39.39 J2.6
PB6  (via drill 0.33)
  Top 0.254: U$6.30 25.09,29.54 25.67,30.11 26.57,30.11 | 26.57,30.11 27.7,30.11 v28.34,30.75 | J2.2 25.79,44.6 24.27,46.12 20.73,46.12 R17.1 | 26.57,30.11 MEGA32U4.30
  Bottom 0.254: v28.34,30.75 29.99,30.75 30.37,31.13 30.37,41.8 27.69,44.48 J2.2
PC6
  Top 0.203: U$6.31 24.83,30.04 25.67,30.88 26.53,30.88
  Top 0.254: 26.53,30.88 MEGA32U4.31
PD5
  Top 0.254: U$6.22 23.53,25.26 24.91,23.89 24.91,22.85 MEGA32U4.22
PD6
  Top 0.203: 26.69,26.94 MEGA32U4.26 | MEGA32U4.26
  Top 0.254: U$6.26 24.94,27.54 25.42,27.07 25.92,27.07 26.05,26.94
  Top 0.305: 26.05,26.94 26.69,26.94
PE2
  Top 0.203: 24.07,31.18 25.42,32.53 26.58,32.53
  Top 0.254: U$6.33 24.07,31.18 | 26.58,32.53 MEGA32U4.33
PE6
  Top 0.203: 17.54,31.13 17.54,31.06 U$6.1
  Top 0.254: MEGA32U4.1 16.13,32.54 17.54,31.13
SCK
  Top 0.203: U$6.9 17.01,27.04 16.15,26.18 | NTB0104.10 8.37,12.43 9.16,13.22 9.16,15 10.05,15.89 10.05,23.51 12.68,26.14 MEGA32U4.9 14.9,26.05
  Top 0.254: 16.15,26.18 15.13,26.18 15.13,26.14 MEGA32U4.9
SCL  (via drill 0.33)
  Top 0.203: 21.61,22.75 21.61,21.22 23,19.83 24.15,19.83 24.65,19.32 25.67,19.32 26.18,18.81 v26.18,18.43 | R7.1 30.61,13.9
  Top 0.254: U$6.18 21.29,23.95 21.61,23.64 21.61,22.75 MEGA32U4.18 | 32.66,43.2 32.66,44.21 27.32,49.55 v24.27,49.55 U1.5 | 30.61,13.9 30.76,13.9 I2C.3
  Top 0.305: I2C.3 32.08,14.05 32.66,14.62 32.66,43.2
  Bottom 0.203: I2C.3 30.69,13.99 27.96,13.99 26.18,15.76 v26.18,18.43
  Bottom 0.254: SENSOR.12 17.88,55.86 19.19,57.17 22.88,57.17 24.27,55.77 v24.27,49.55
SDA  (via drill 0.33)
  Top 0.203: U$6.19 21.79,24.47 22.37,23.89 22.37,22.76 22.37,21.22 23.26,20.34 24.4,20.34 24.91,19.83 26.3,19.83 v27.45,18.68 | R6.1 27.83,16.02 30.19,16.02 I2C.2
  Top 0.254: 22.37,22.76 MEGA32U4.19 | U1.4 22.61,49.05 v23.13,48.53 27.45,48.53 32.02,43.96 32.02,43.7
  Top 0.305: v27.45,18.68 27.45,19.32 28.72,20.59 30.88,20.59 32.02,21.73 32.02,43.7
  Bottom 0.203: I2C.2 30.19,17.16 28.21,17.16 27.45,17.92 v27.45,18.68
  Bottom 0.254: SENSOR.11 17.8,53.36 19.07,54.63 22.88,54.63 23.64,53.86 23.64,50.18 23.13,49.67 v23.13,48.53
SENSOR_LED
  Top 0.203: T3.1 22.96,7.2 ROUTER.16
SS
  Top 0.203: U$6.8 16.87,27.54 16.4,27.07 15.12,27.07 | MEGA32U4.8 14.87,26.81 12.72,26.81 9.54,23.64 9.54,16.4 8.91,15.76 7.76,15.76 6.87,14.88 NTB0104.13
  Top 0.254: 15.12,27.07 MEGA32U4.8
UART_RX
  Top 0.203: U3.5 16.47,8.71 17.41,7.76 18.56,7.76 19.07,7.25 19.07,5.87 ROUTER.14
UART_RXD1  (via drill 0.33)
  Top 0.203: U$6.20 22.29,24.6 23.13,23.76 23.13,22.8 | MEGA32U4.20 23.19,21.42 23.77,20.84 24.78,20.84 25.29,20.34 v27.07,20.34 | v16.65,11.57 16.65,11.02 U3.8
  Top 0.254: 23.13,22.8 MEGA32U4.20
  Bottom 0.203: v16.65,11.57 18.43,13.35 22.88,13.35 24.78,15.26 24.78,19.19 25.92,20.34 v27.07,20.34
UART_TX
  Top 0.203: ROUTER.13 17.8,4.6 17.8,6.62 17.29,7.13 16.78,7.13 15.22,8.69 U3.4
UART_TXD1  (via drill 0.33)
  Top 0.203: U3.1 15.24,11.69 v15.26,11.7 | v26.3,21.35 24.27,21.35 24.02,21.61 24.02,22.71 MEGA32U4.21
  Top 0.254: U$6.21 22.79,24.74 23.89,23.64 23.89,22.84 MEGA32U4.21
  Bottom 0.203: v15.26,11.7 15.89,12.34 16.65,12.34 18.18,13.86 22.62,13.86 24.27,15.51 24.27,19.32 v26.3,21.35
USB1_N
  Top 0.203: J3.P2 5.43,29.63 5.48,29.58 6.75,29.58 | 6.75,29.58 9.29,29.58 9.57,29.86 R3.2 | U4.2 6.63,29.7 6.75,29.58
USB1_P
  Top 0.203: J3.P3 5.33,28.97 5.48,29.12 6.62,29.12 | 6.62,29.12 9.29,29.12 9.57,28.84 R4.2 | U4.3 6.63,29.11 6.62,29.12
USB_N
  Top 0.203: U$6.3 16.73,30.04 15.89,30.88 15.06,30.88 | R3.1 11.29,29.58 11.86,29.58 13.22,30.94 MEGA32U4.3
  Top 0.305: 15.06,30.88 MEGA32U4.3
USB_P
  Top 0.203: U$6.4 16.47,29.54 15.89,30.11 15.02,30.11 | R4.1 11.29,29.12 12.05,29.12 13.06,30.14 MEGA32U4.4
  Top 0.305: 15.02,30.11 MEGA32U4.4
USB_VCC  (via drill 0.33)
  Top 0.406: J3.P1 5.48,30.29 5.48,32.4 v5.86,32.4 6.37,32.4 C11.+ 6.37,34.36 C18.1 | v8.4,26.94 8.56,26.94 U4.4
  Bottom 0.406: v5.86,32.4 8.4,32.4 v8.4,26.94
VCC  (via drill 0.33)
  Top 0.61: F2.1 v3.32,39.51
  Bottom 0.61: v3.32,39.51 3.32,33.16 3.06,32.91 3.06,22.62 4.84,20.84 4.84,18.3 4.33,17.8 2.75,17.8 VOUT_SEL.2
VOUT
  Top 0.254: SENSOR.4 7.8,55.86 9.03,54.63 10.68,54.63 11.45,53.86 11.45,50.84 U2.1
  Top 0.61: F2.2 3.32,57.42 7.51,57.42 7.51,55.86 SENSOR.4
XTAL1
  Top 0.203: MEGA32U4.16 19.99,20.76 R16.2 20.65,19.64 20.97,19.32 20.97,17.54 20.46,17.03 20.09,17.03 X1.3 20,16.66 C14.2
  Top 0.254: U$6.16 20.29,23.85 19.95,23.51 19.95,22.78 MEGA32U4.16
XTAL2
  Top 0.203: C9.2 23.51,18.65 X1.1 21.56,19.25 R16.1 21.56,20.38 20.84,21.1 20.84,22.69 MEGA32U4.17
  Top 0.254: U$6.17 MEGA32U4.17

### Text on the board
tDocu: 3.3v | 5V | VOUT | Model: M32 V1.2 | SDA | 5v | SCL | GND | Internet of Things Module
bDocu: down | 5v_up | down | up | D6 | D6 | D4 | D4
214bmp: D:/SmartProjects/Snc/a4_bn_logo2.bmp